# Altium project antivape_testbench.PrjPcb
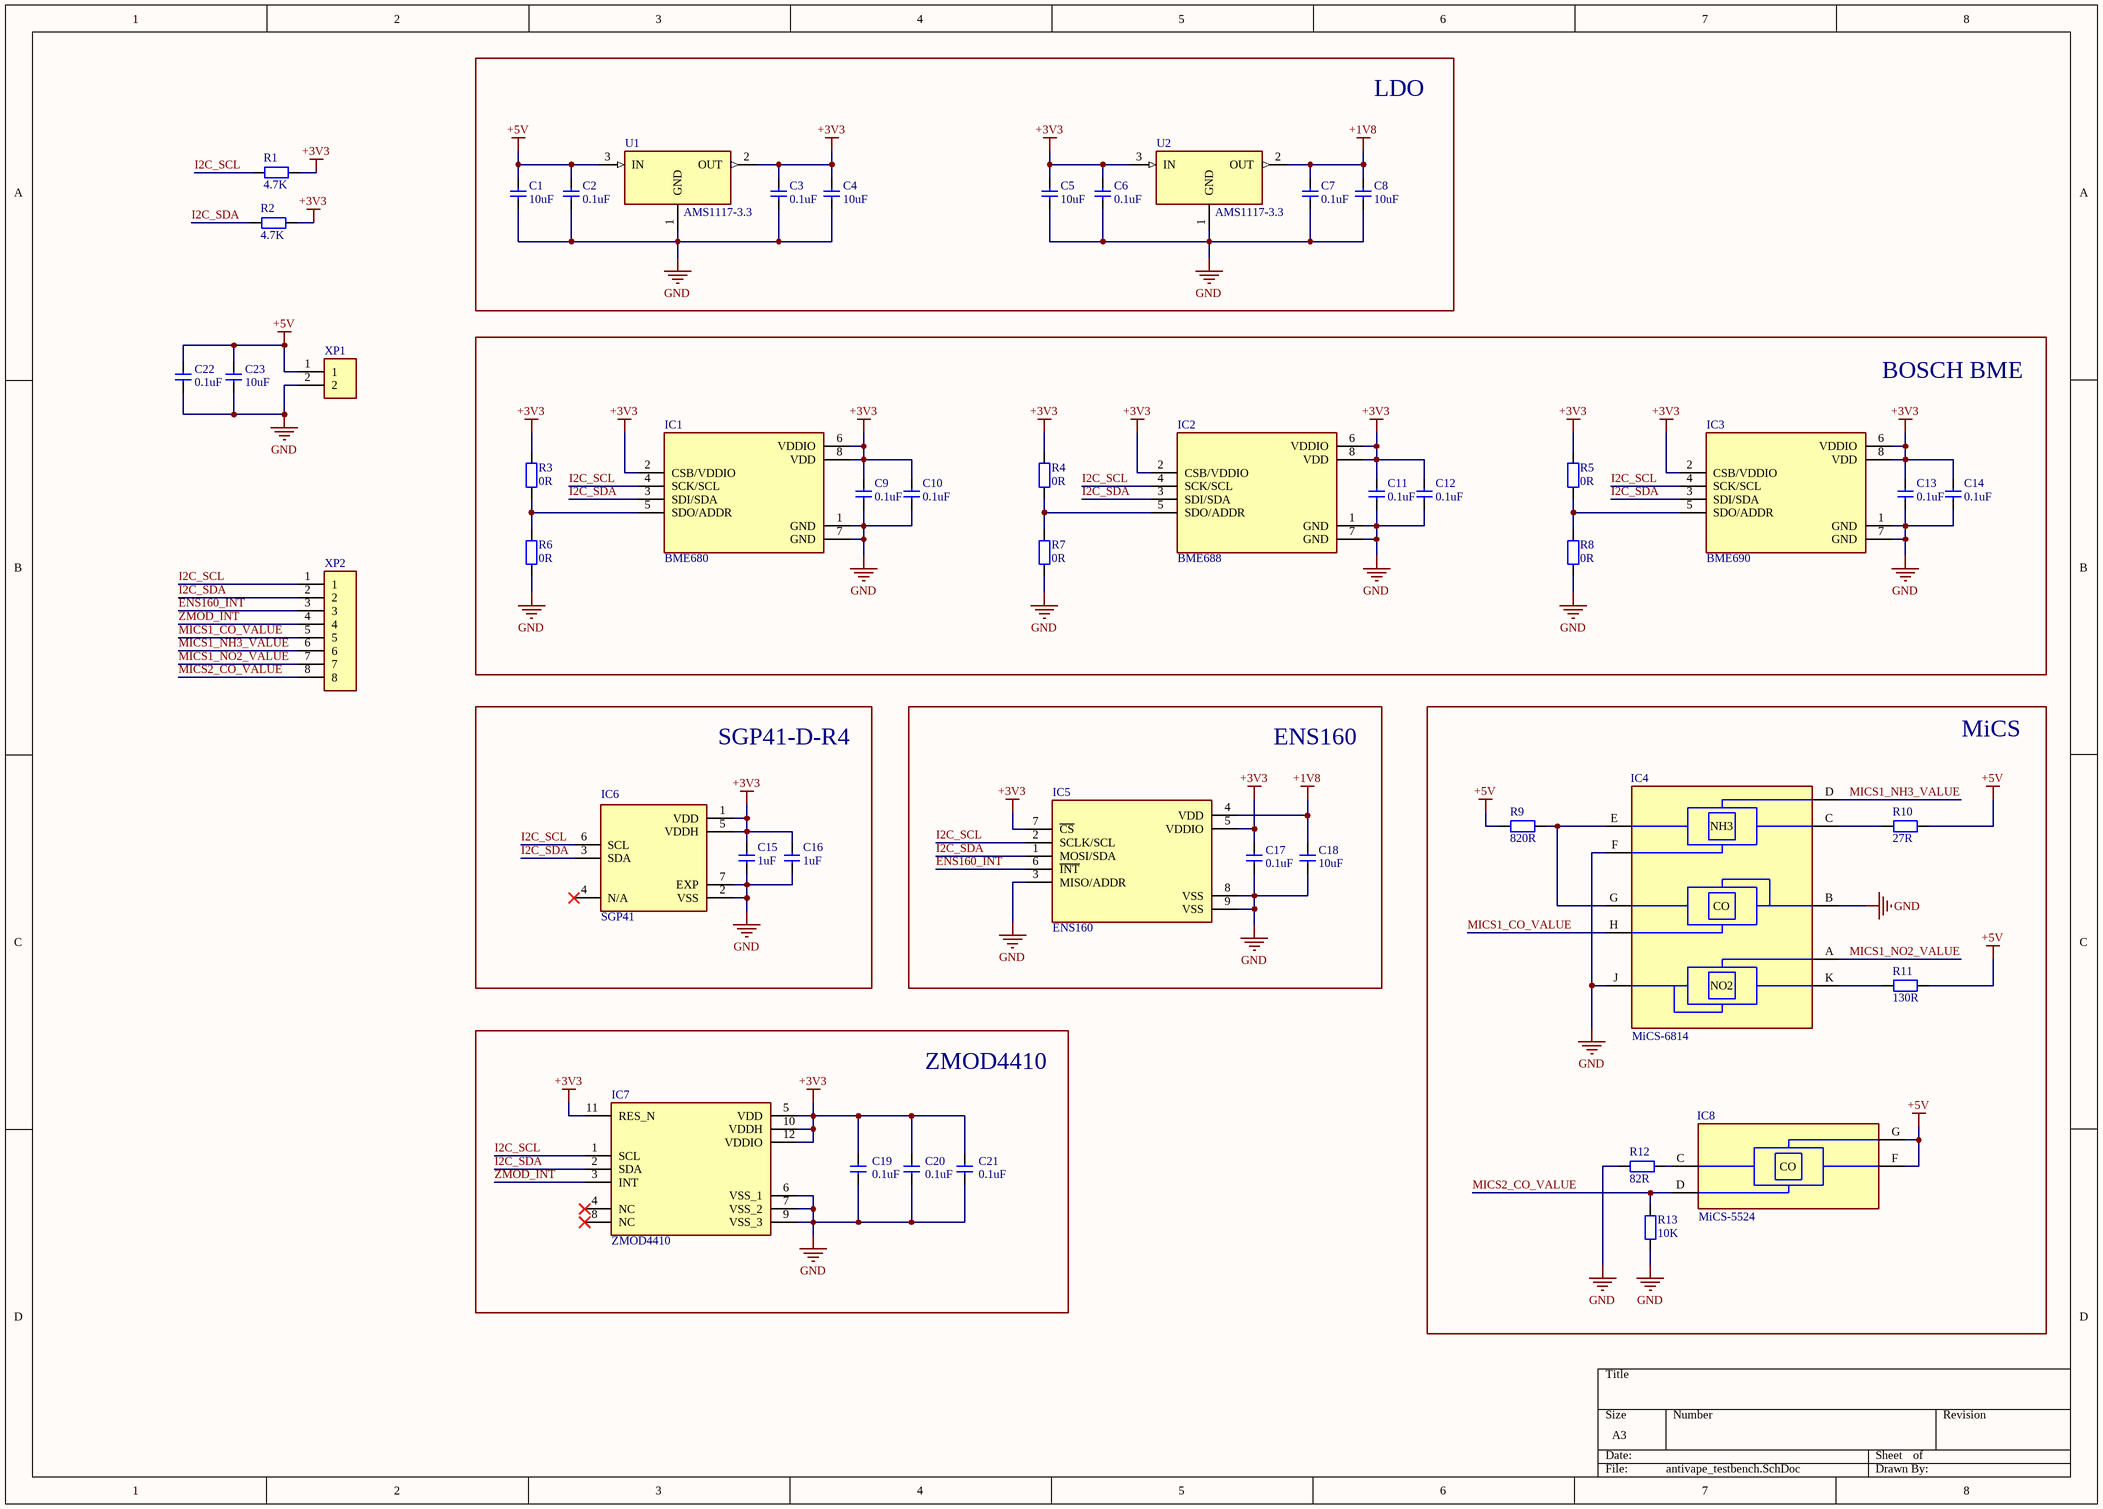
[diagram p0: antivape_testbench.SchDoc]
1 sheet, 48 parts. Net scope: global (net labels, ports and power ports of the same name join across sheets).
Board file: antivape_testbench.PcbDoc

## Sheet antivape_testbench.SchDoc
size A3; SheetNumber: 1; SheetTotal: 1

### Parts
C1  10uF  [CAP0805]
C2  0.1uF  [CAP0805]
C3  0.1uF  [CAP0805]
C4  10uF  [CAP0805]
C5  10uF  [CAP0805]
C6  0.1uF  [CAP0805]
C7  0.1uF  [CAP0805]
C8  10uF  [CAP0805]
C9  0.1uF  [CAP0603]
C10  0.1uF  [CAP0603]
C11  0.1uF  [CAP0603]
C12  0.1uF  [CAP0603]
C13  0.1uF  [CAP0603]
C14  0.1uF  [CAP0603]
C15  1uF  [CAP0603]
C16  1uF  [CAP0603]
C17  0.1uF  [CAP0603]
C18  10uF  [CAP0805]
C19  0.1uF  [CAP0603]
C20  0.1uF  [CAP0603]
C21  0.1uF  [CAP0603]
C22  0.1uF  [CAP0805]
C23  10uF  [CAP0805]
IC1  BME680  [BMEXXX]
IC2  BME688  [BMEXXX]
IC3  BME690  [BMEXXX]
IC4  MiCS-6814  [MiCS-6814]
IC5  ENS160  [ENS160]
IC6  SGP41  [SGP41-D-R4]
IC7  ZMOD4410  [ZMOD4410]
IC8  MiCS-5524  [MiCS-6814]
R1  4.7K  [RES0603]
R2  4.7K  [RES0603]
R3  0R  [RES0603]
R4  0R  [RES0603]
R5  0R  [RES0603]
R6  0R  [RES0603]
R7  0R  [RES0603]
R8  0R  [RES0603]
R9  820R  [RES0805]
R10  27R  [RES0805]
R11  130R  [RES0805]
R12  82R  [RES0805]
R13  10K  [RES0805]
U1  AMS1117-3.3  [SOT-223]
U2  AMS1117-3.3  [SOT-223]
XP1  Conn-2  [PLS-2]  (value not drawn)
XP2  Conn-8  [PLS 8x2.54]  (value not drawn)

### Blocks framed on the sheet
LDO: C1-C8 U1 U2
BOSCH BME: C9-C14 IC1-IC3 R3-R8
SGP41-D-R4: C15 C16 IC6
ENS160: C17 C18 IC5
MiCS: IC4 IC8 R9-R13
ZMOD4410: C19-C21 IC7

### Nets
+1V8: C7.2 C8.2 C18.2 IC5.4(VDD) U2.2(OUT)
+3V3: C3.2 C4.2 C5.2 C6.2 C9.2 C10.2 C11.2 C12.2 C13.2 C14.2 C15.2 C16.2 C17.2 C19.2 C20.2 C21.2 IC1.2(CSB/VDDIO) IC1.6(VDDIO) IC1.8(VDD) IC2.2(CSB/VDDIO) IC2.6(VDDIO) IC2.8(VDD) IC3.2(CSB/VDDIO) IC3.6(VDDIO) IC3.8(VDD) IC5.5(VDDIO) IC5.7(~{CS}) IC6.1(VDD) IC6.5(VDDH) IC7.5(VDD) IC7.10(VDDH) IC7.11(RES_N) IC7.12(VDDIO) R1.2 R2.2 R3.2 R4.2 R5.2 U1.2(OUT) U2.3(IN)
+5V: C1.2 C2.2 C22.2 C23.2 IC8.F(RH1/RS1_RED) IC8.G(RS1_NH3) R9.1 R10.2 R11.2 U1.3(IN) XP1.1
GND: C1.1 C2.1 C3.1 C4.1 C5.1 C6.1 C7.1 C8.1 C9.1 C10.1 C11.1 C12.1 C13.1 C14.1 C15.1 C16.1 C17.1 C18.1 C19.1 C20.1 C21.1 C22.1 C23.1 IC1.1(GND) IC1.7(GND) IC2.1(GND) IC2.7(GND) IC3.1(GND) IC3.7(GND) IC4.B(RH1/RS1_RED) IC4.F(RS2_NH3) IC4.J(RH1/RS1_OX) IC5.3(MISO/ADDR) IC5.8(VSS) IC5.9(VSS) IC6.2(VSS) IC6.7(EXP) IC7.6(VSS_1) IC7.7(VSS_2) IC7.9(VSS_3) R6.1 R7.1 R8.1 R12.1 R13.1 U1.1(GND) U2.1(GND) XP1.2
ENS160_INT: IC5.6(~{INT}) XP2.3
I2C_SCL: IC1.4(SCK/SCL) IC2.4(SCK/SCL) IC3.4(SCK/SCL) IC5.2(SCLK/SCL) IC6.6(SCL) IC7.1(SCL) R1.1 XP2.1
I2C_SDA: IC1.3(SDI/SDA) IC2.3(SDI/SDA) IC3.3(SDI/SDA) IC5.1(MOSI/SDA) IC6.3(SDA) IC7.2(SDA) R2.1 XP2.2
MICS1_CO_VALUE: IC4.H(RS2_RED) XP2.5
MICS1_NH3_VALUE: IC4.D(RS1_NH3) XP2.6
MICS1_NO2_VALUE: IC4.A(RS2) XP2.7
MICS2_CO_VALUE: IC8.D(RS2_RED) R13.2 XP2.8
ZMOD_INT: IC7.3(INT) XP2.4
NetIC1_5: IC1.5(SDO/ADDR) R3.1 R6.2
NetIC2_5: IC2.5(SDO/ADDR) R4.1 R7.2
NetIC3_5: IC3.5(SDO/ADDR) R5.1 R8.2
NetIC4_C: IC4.C(RH1_NH3) R10.1
NetIC4_E: IC4.E(RH2_NH3) IC4.G(RH2_RED) R9.2
NetIC4_K: IC4.K(RH2_OX) R11.1
NetIC8_C: IC8.C(RH2_RED) R12.2

Not connected (* = marked no-connect by the designer): IC6 4(N/A)*; IC7 4(NC)* 8(NC)*

### Notes on the sheet
- (in symbol MiCS-5524) CO
- (in symbol MiCS-6814) NH3; CO; NO2

### Library data of the parts
C1-C23 = CAP Ceramic: Ceramic SMD Cap
IC6 = SGP41-D-R4
R1-R13 = RES: RES smd
U1 U2 = AMS1117: Linear voltage regulator; ComponentLink1Description: ChipDip; ComponentLink1URL: https://www.chipdip.ru/product0/9001729041